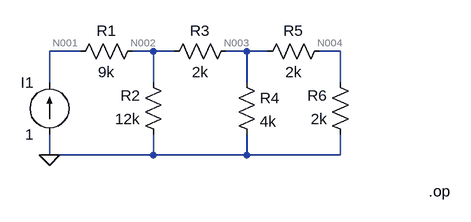
[diagram p0: schematic Lab03_02c.asc]
Lab03_02c.asc, the LTspice schematic file:
Version 4
SHEET 1 880 680
WIRE 128 64 80 64
WIRE 240 64 208 64
WIRE 272 64 240 64
WIRE 384 64 352 64
WIRE 416 64 384 64
WIRE 528 64 496 64
WIRE 80 112 80 64
WIRE 240 112 240 64
WIRE 384 112 384 64
WIRE 528 112 528 64
WIRE 80 224 80 192
WIRE 240 224 240 192
WIRE 240 224 80 224
WIRE 384 224 384 192
WIRE 384 224 240 224
WIRE 528 224 528 192
WIRE 528 224 384 224
FLAG 80 224 0
DATAFLAG 80 64 ""
SYMBOL current 80 192 R180
WINDOW 0 24 80 Left 2
WINDOW 3 24 0 Left 2
SYMATTR InstName I1
SYMATTR Value 1
SYMBOL res 224 48 R90
WINDOW 0 0 56 VBottom 2
WINDOW 3 32 56 VTop 2
SYMATTR InstName R1
SYMATTR Value 9k
SYMBOL res 256 208 R180
WINDOW 0 36 76 Left 2
WINDOW 3 36 40 Left 2
SYMATTR InstName R2
SYMATTR Value 12k
SYMBOL res 256 80 R270
WINDOW 0 32 56 VTop 2
WINDOW 3 0 56 VBottom 2
SYMATTR InstName R3
SYMATTR Value 2k
SYMBOL res 368 96 R0
SYMATTR InstName R4
SYMATTR Value 4k
SYMBOL res 512 48 R90
WINDOW 0 0 56 VBottom 2
WINDOW 3 32 56 VTop 2
SYMATTR InstName R5
SYMATTR Value 2k
SYMBOL res 544 208 R180
WINDOW 0 36 76 Left 2
WINDOW 3 36 40 Left 2
SYMATTR InstName R6
SYMATTR Value 2k
TEXT 664 280 Left 2 !.op

The netlist it stands for:
* Lab03_02c.asc
I1 0 N001 1
R1 N002 N001 9k
R2 0 N002 12k
R3 N002 N003 2k
R4 N003 0 4k
R5 N004 N003 2k
R6 0 N004 2k
.op
.backanno
.end

* Results of the author's LTspice run, read from the files saved beside the schematic
* Operating Point:
*   V(n001) = 12 kV
*   V(n002) = 3 kV
*   V(n003) = 1.5 kV
*   V(n004) = 750 V
*   I(I1) = 1 A
*   I(R1) = -1 A
*   I(R2) = -250 mA
*   I(R3) = 750 mA
*   I(R4) = 375 mA
*   I(R5) = -375 mA
*   I(R6) = -375 mA